# EAGLE design seeeduino nano (EAGLE 9.2.2)
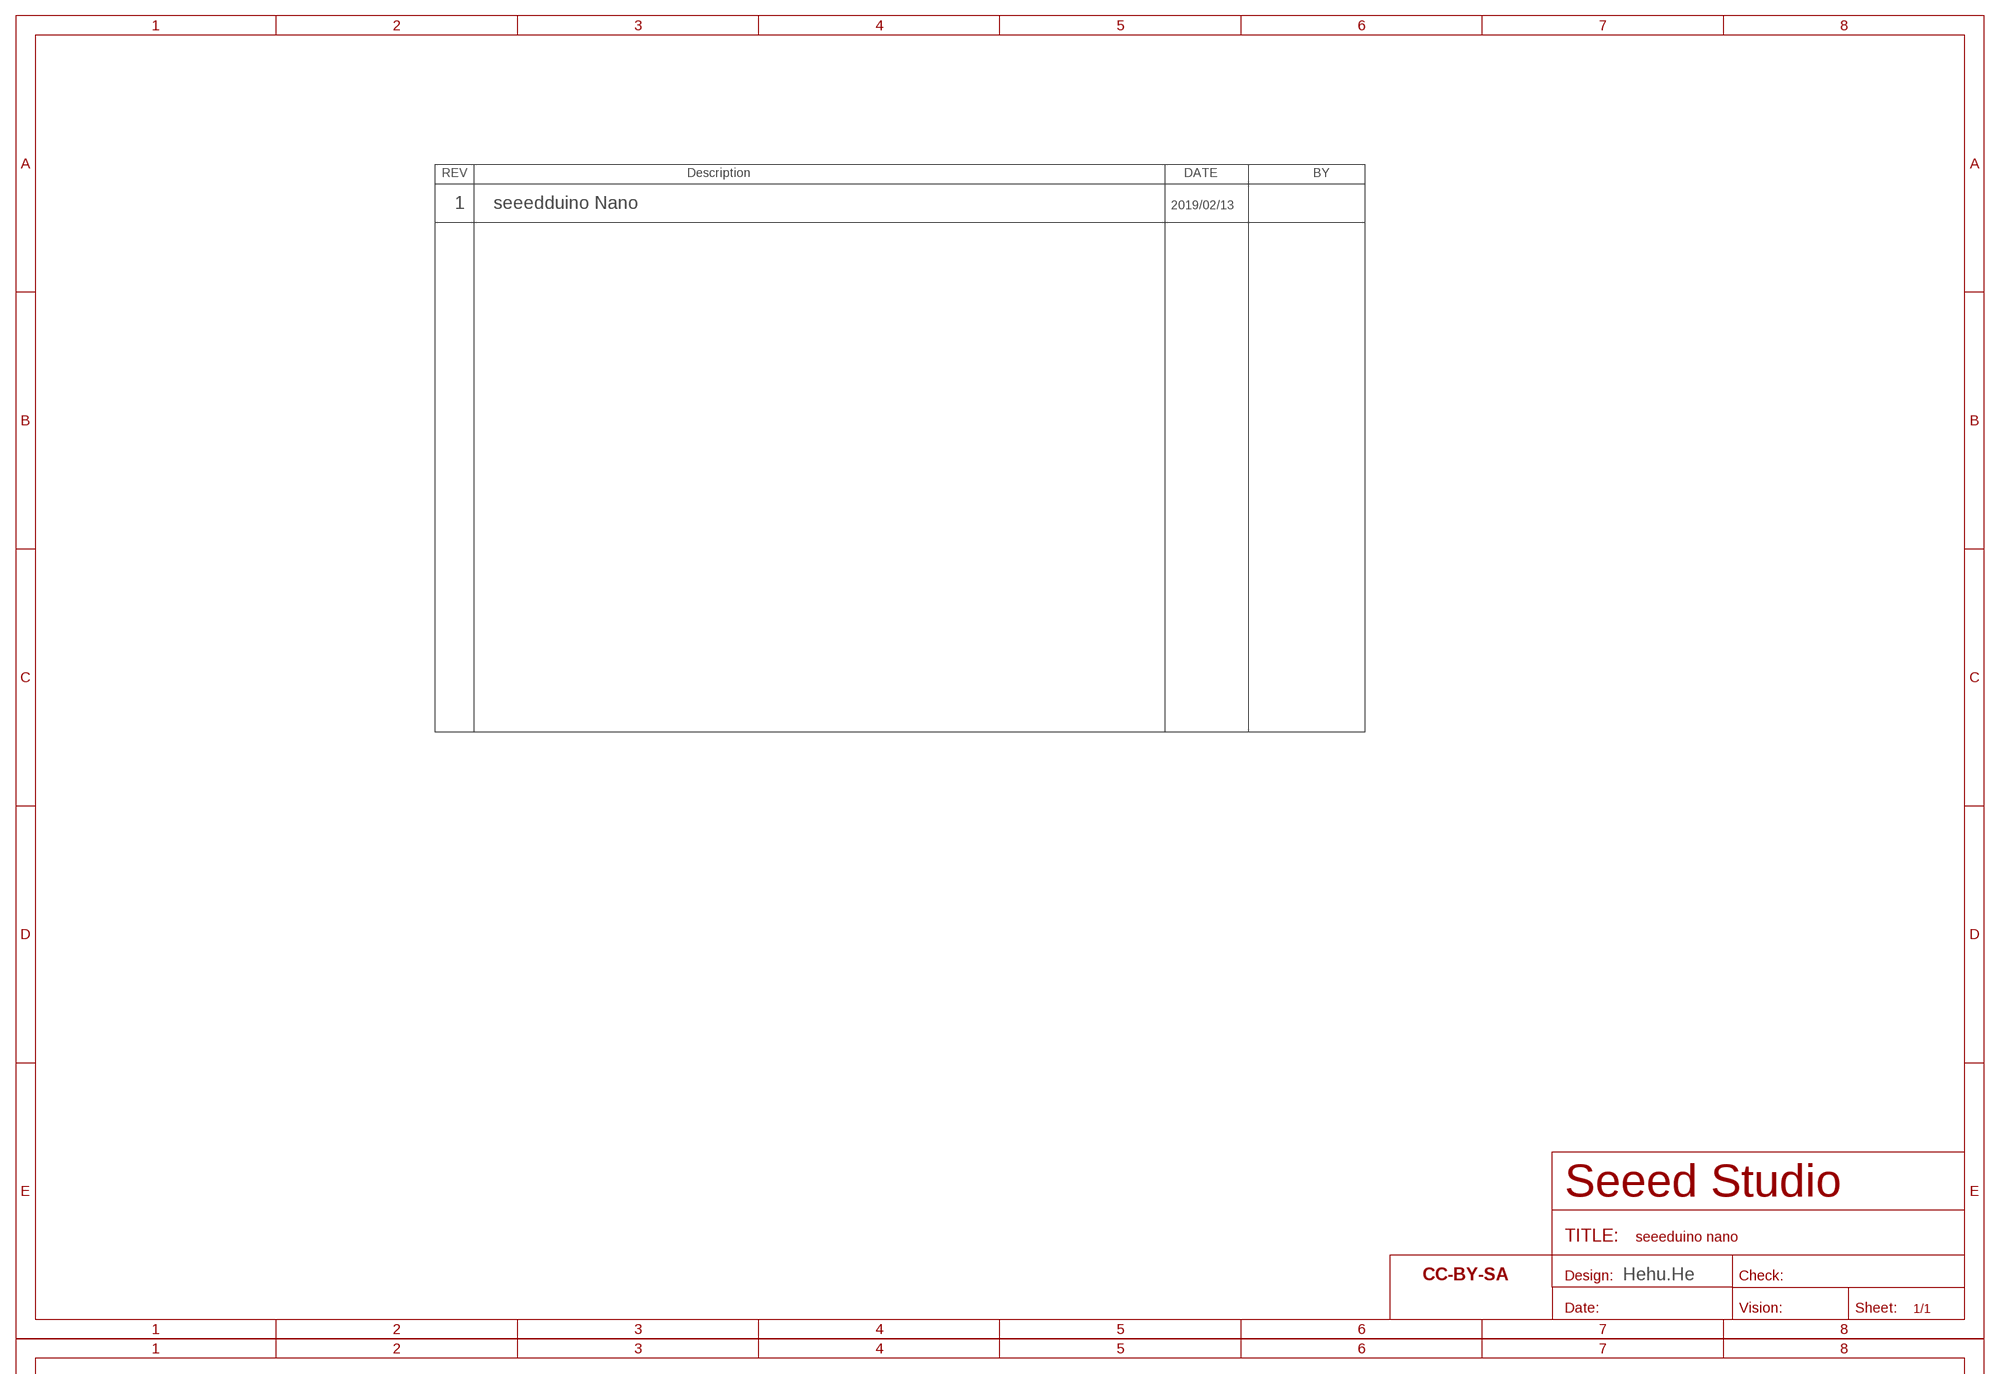
[diagram p0: schematic, sheet 1, part 1 of 2]
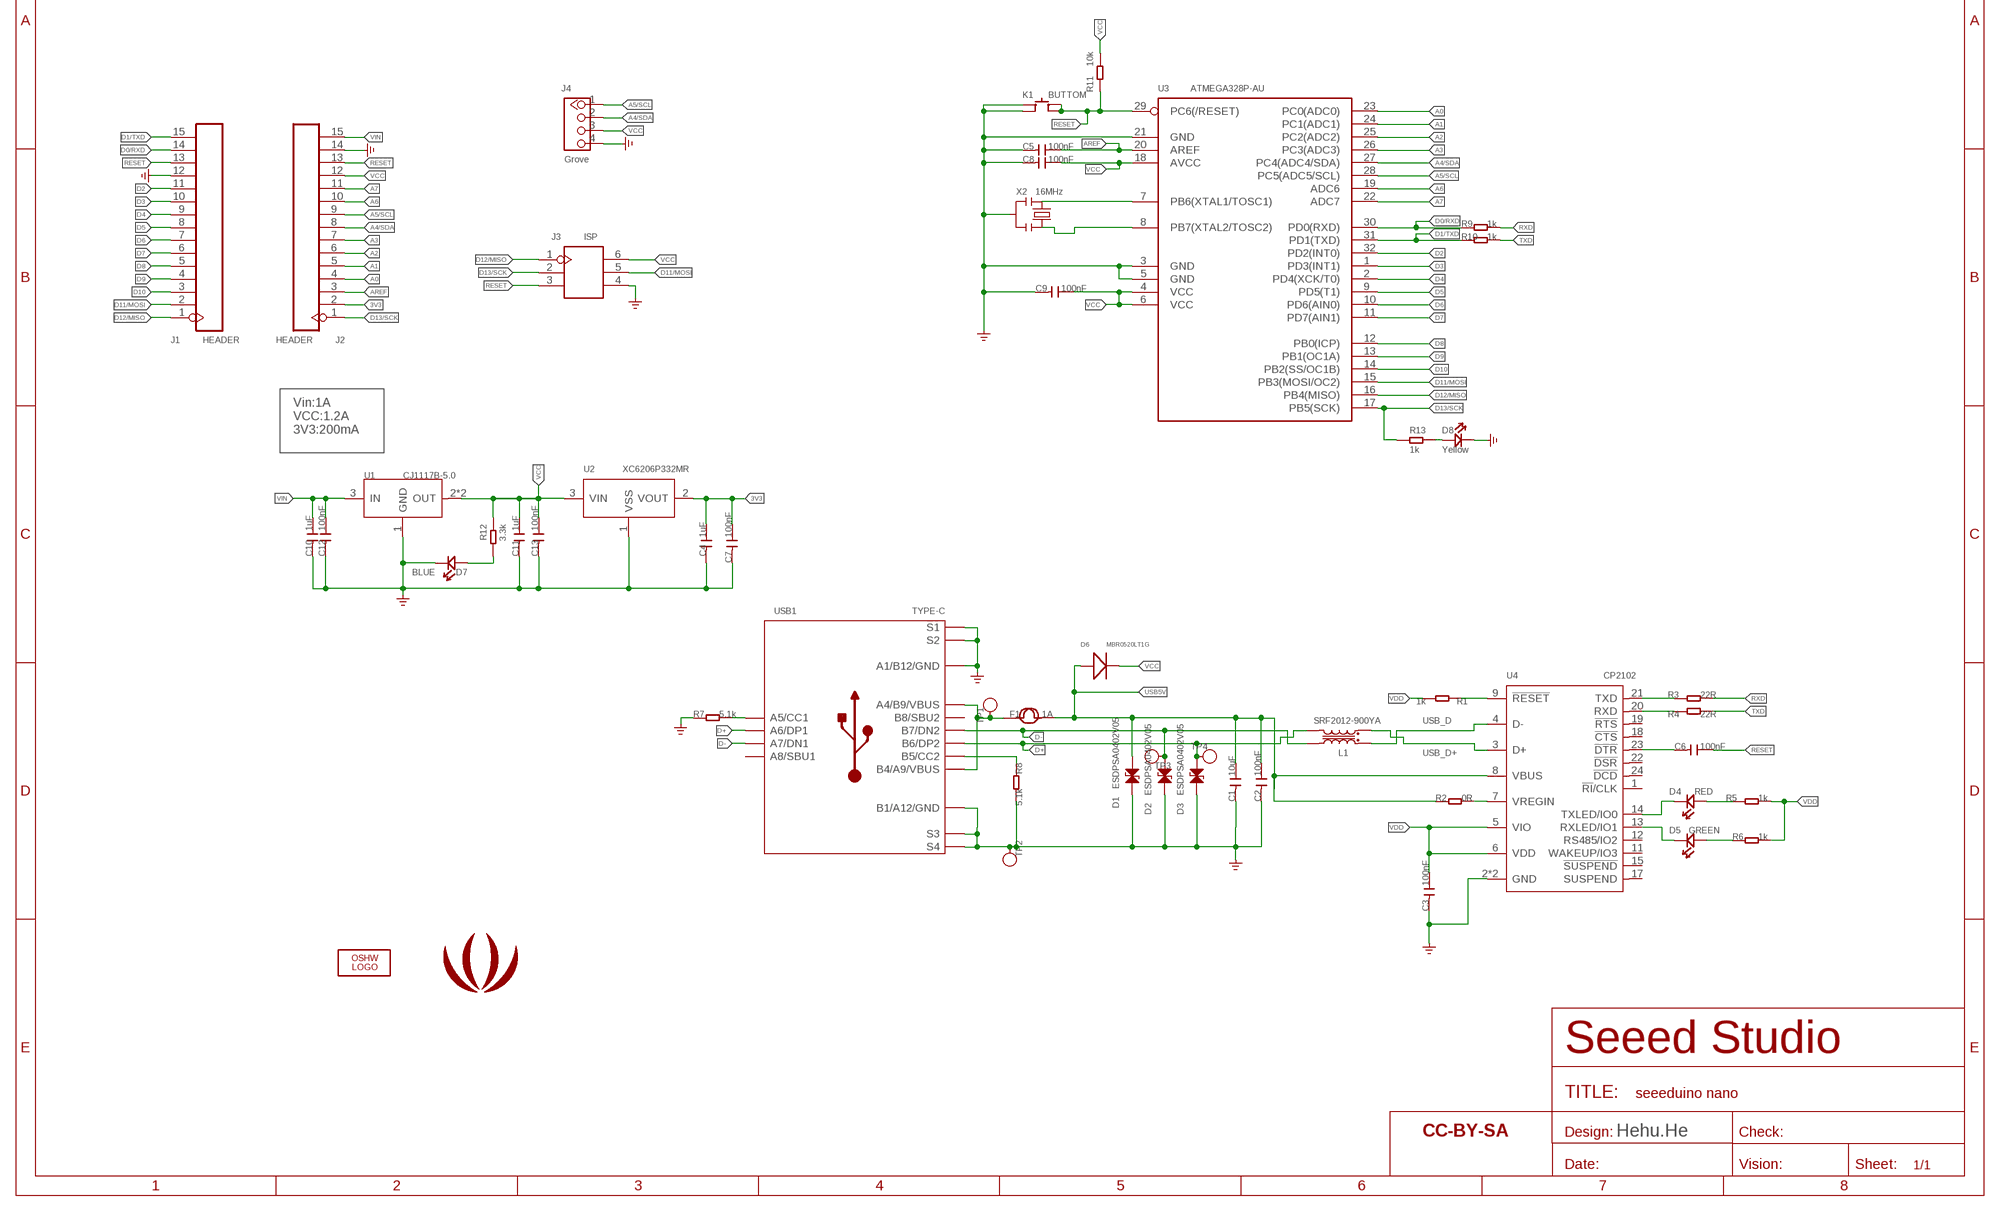
[diagram p1: schematic, sheet 1, part 2 of 2]

## Parts
C1  10uF  CAP-0603  [C0603]
C2  100nF  CAP-0603  [C0603]
C3  100nF  C-0603  [C0603]
C4  1uF  C-0603  [C0603]
C5  100nF  C-0603  [C0603]
C6  100nF  C-0603  [C0603]
C7  100nF  C-0603  [C0603]
C8  100nF  C-0603  [C0603]
C9  100nF  C-0603  [C0603]
C10  1uF  C-0603  [C0603]
C11  1uF  C-0603  [C0603]
C12  100nF  C-0603  [C0603]
C13  100nF  C-0603  [C0603]
D1  ESDPSA0402V05  D-ESD-2P-DOUBLE-0402  [ESD-0402]
D2  ESDPSA0402V05  D-ESD-2P-DOUBLE-0402  [ESD-0402]
D3  ESDPSA0402V05  D-ESD-2P-DOUBLE-0402  [ESD-0402]
D4  RED  LED-0402  [LED-0402]
D5  GREEN  LED-0402  [LED-0402]
D6  MBR0520LT1G  D'MBR0520LT1'  [SOD123-2.7X1.6]
D7  BLUE  LED-0402  [LED-0402]
D8  Yellow  LED-0402  [LED-0402]
F1  1A  FUSE'1206'  [F1206]
J1  HEADER  HEADER-15P'2.54'  [H15-2.54]
J2  HEADER  HEADER-15P'2.54'  [H15-2.54]
J3  ISP  HEADER-2X3P-2.54  [H2X3-2.54]
J4  Grove  GROVE-CONNECTOR-DIP-2.0  [HW4-2.0]
K1  BUTTOM  BUTTON-4P-4.5X3.2  [SW4P-SMD-4.5X3.2X2.5MM]
L1  SRF2012-900YA  INDUCTOR-COMMON-MODE-SRF2012-900YA  [INT4-0.85-2X1.25X1.2MM]
LOGO1  LOGO-OSHW-FILLX0100-NT  [OSHW_FILLX100_NOTEXT]
R1  1k  R-0603  [R0603]
R2  0R  R-0603  [R0603]
R3  22R  R-0603  [R0603]
R4  22R  R-0603  [R0603]
R5  1k  R-0603  [R0603]
R6  1k  R-0603  [R0603]
R7  5.1k  R-0603  [R0603]
R8  5.1k  R-0603  [R0603]
R9  1k  R-0603  [R0603]
R10  1k  R-0603  [R0603]
R11  10k  R-0603  [R0603]
R12  3.3k  R-0603  [R0603]
R13  1k  R-0603  [R0603]
TP1  TEST  TEST-POINT'4545'  [TP-D45MIL]
TP2  TEST  TEST-POINT'4545'  [TP-D45MIL]
TP3  TEST  TEST-POINT'4545'  [TP-D45MIL]
TP4  TEST  TEST-POINT'4545'  [TP-D45MIL]
U1  CJ1117B-5.0  PMIC-CJ1117S  [SOT-223]
U2  XC6206P332MR  PMIC-XC6206PMR  [SOT-23]
U3  ATMEGA328P-AU  MCU-ATMEGA8/168/328'AU'  [TQFP32-0.8-7X7MM]
U4  CP2102  CONVERTER-CP2102N(QFN24)  [QFN24G-0.5-4X4MM]
U$2  LOGO-SEEED-SMALL-SILK  [SEEED-SILK--TNAME-160*153MIL]
USB1  TYPE-C  USB2.0-TYPE-C  [USB2.0-TYPE-C]
X2  16MHz  CRYSTAL-RESONATOR  [RESONATOR3-SMD-3.6X1.3X0.8MM]

## Nets
3V3: C4.1 C7.1 J2.2 U2.2(VOUT)
A0: J2.4 U3.23(PC0(ADC0))
A1: J2.5 U3.24(PC1(ADC1))
A2: J2.6 U3.25(PC2(ADC2))
A3: J2.7 U3.26(PC3(ADC3))
A4/SDA: J2.8 J4.2 U3.27(PC4(ADC4/SDA))
A5/SCL: J2.9 J4.1 U3.28(PC5(ADC5/SCL))
A6: J2.10 U3.19(ADC6)
A7: J2.11 U3.22(ADC7)
AREF: C5.1 J2.3 U3.20(AREF)
D0/RXD: J1.14 R9.1 U3.30(PD0(RXD))
D1/TXD: J1.15 R10.1 U3.31(PD1(TXD))
D2: J1.11 U3.32(PD2(INT0))
D3: J1.10 U3.1(PD3(INT1))
D4: J1.9 U3.2(PD4(XCK/T0))
D5: J1.8 U3.9(PD5(T1))
D6: J1.7 U3.10(PD6(AIN0))
D7: J1.6 U3.11(PD7(AIN1))
D8: J1.5 U3.12(PB0(ICP))
D9: J1.4 U3.13(PB1(OC1A))
D10: J1.3 U3.14(PB2(SS/OC1B))
D11/MOSI: J1.2 J3.5 U3.15(PB3(MOSI/OC2))
D12/MISO: J1.1 J3.1 U3.16(PB4(MISO))
D13/SCK: J2.1 J3.2 R13.1 U3.17(PB5(SCK))
D+: D3.2 L1.3 TP4.T USB1.A6(A6/DP1) USB1.B6(B6/DP2)
D-: D2.2 L1.2 TP3.T USB1.A7(A7/DN1) USB1.B7(B7/DN2)
GND: C1.2 C2.2 C3.2 C4.2 C5.2 C7.2 C8.2 C9.2 C10.2 C11.2 C12.2 C13.2 D1.1 D2.1 D3.1 D7.- D8.- J1.12 J2.14 J3.4 J4.4 K1.1(A0) K1.2(A1) R7.1 R8.2 TP2.T U1.1(GND) U2.1(VSS) U3.3(GND) U3.5(GND) U3.21(GND) U4.2(GND) U4.PAD(GND) USB1.A1_B12(A1/B12/GND) USB1.B1_A12(B1/A12/GND) USB1.S1 USB1.S2 USB1.S3 USB1.S4 USB1.S5(S1) USB1.S6(S2) X2.2 ; supply symbol labelled GND_POWER
N$1: R7.2 USB1.A5(A5/CC1)
N$2: R8.1 USB1.B5(B5/CC2)
N$3: D8.+ R13.2
N$4: F1.1 TP1.T USB1.A4_B9(A4/B9/VBUS) USB1.B4_A9(B4/A9/VBUS)
N$5: C6.2 U4.23(!DTR!)
N$6: D4.+ R5.1
N$7: U3.7(PB6(XTAL1/TOSC1)) X2.1
N$8: D5.- U4.13(RXLED/IO1)
N$9: U3.8(PB7(XTAL2/TOSC2)) X2.3
N$10: D7.+ R12.2
N$11: D5.+ R6.1
N$18: D4.- U4.14(TXLED/IO0)
N$19: R4.1 U4.20(RXD)
N$20: R3.1 U4.21(TXD)
N$24: R2.2 U4.7(VREGIN)
N$25: R1.2 U4.9(!RESET!)
RESET: C6.1 J1.13 J2.13 J3.3 K1.3(B0) K1.4(B1) R11.1 U3.29(PC6(/RESET))
RXD: R3.2 R9.2
TXD: R4.2 R10.2
USB5V: C1.1 C2.1 D1.2 D6.1(+) F1.2 R2.1 U4.8(VBUS)
USB_D: L1.1 U4.4(D-)
USB_D+: L1.4 U4.3(D+)
VCC: C8.1 C9.1 C11.1 C13.1 D6.2(-) J2.12 J3.6 J4.3 R11.2 R12.1 U1.2(OUT) U1.TER(OUT) U2.3(VIN) U3.4(VCC) U3.6(VCC) U3.18(AVCC)
VDD: C3.1 R1.1 R5.2 R6.2 U4.5(VIO) U4.6(VDD)
VIN: C10.1 C12.1 J2.15 U1.3(IN)
Unconnected: U4.1(!RI!/CLK) U4.11(WAKEUP/IO3) U4.12(RS485/IO2) U4.15(!SUSPEND!) U4.17(SUSPEND) U4.18(!CTS!) U4.19(!RTS!) U4.22(!DSR!) U4.24(!DCD!) USB1.A8(A8/SBU1) USB1.B8(B8/SBU2)

## Notes on the sheet
- 1 | seeedduino Nano | 2019/02/13
- Hehu.He
- Vin:1A
  VCC:1.2A
  3V3:200mA
- Hehu.He

## Library data of the parts
C1 C2 = Discrete-new:CAP: Ceramic Capacitors
C3-C13 = Discrete-small:C*: Ceramic Capacitors
D1-D3 = Discrete-new:D-ESD-2P-DOUBLE
D4 D5 D7 D8 = Discrete-new:LED
D6 = Discrete-smallsmall:D*
F1 = Discrete-new:FUSE
J1 J2 = Connector-new:HEADER-15P: Header 15 Standard 15-pin 0.1" header. Use with straight break away headers (SKU : PRT-00116), right angle break away headers (PRT-00553), swiss pins (PRT-00743), machine pins (PRT-00117), and female headers (PRT-00115).
J3 = Connector-new:HEADER-2X3P
J4 = Connector-new:GROVE-CONNECTOR-DIP: 4P-2.0:320110033;4P-2.0-90D:320110034
K1 = Switch:BUTTON-4P
L1 = Discrete-new:INDUCTOR-COMMON-MODE
LOGO1 = logo:LOGO-OSHW-FILL; PARTNO: DNP
R1-R13 = Discrete-small:R*
TP1-TP4 = Discrete-new:TEST-POINT; PARTNO: DNP
U1 = IC-new:PMIC-CJ*1117: Low Drop Fixed And Adjustable Positive Voltage Regulators http://www.datasheetcatalog.org/datasheet/SGSThomsonMicroelectronics/mXuqtqv.pdf
U2 = IC-new:PMIC-XC6206P: LOW ESR Cap.Compatible Positive Voltage Regulators
U3 = IC-new:MCU-ATMEGA8/168/328
U4 = IC-new:CONVERTER-CP2102N(QFN24)
U$2 = logo:LOGO-SEEED; PARTNO: DNP
USB1 = Connector-new:USB2.0-TYPE-C
X2 = Discrete-new:CRYSTAL-RESONATOR: Resonator Small SMD resonator. This is the itty bitty 10/20MHz resonators with built in caps. CSTCE10M0G55 and CSTCE20M0V53. Footprint has been reviewed closely but hasn't been tested yet.

## Board
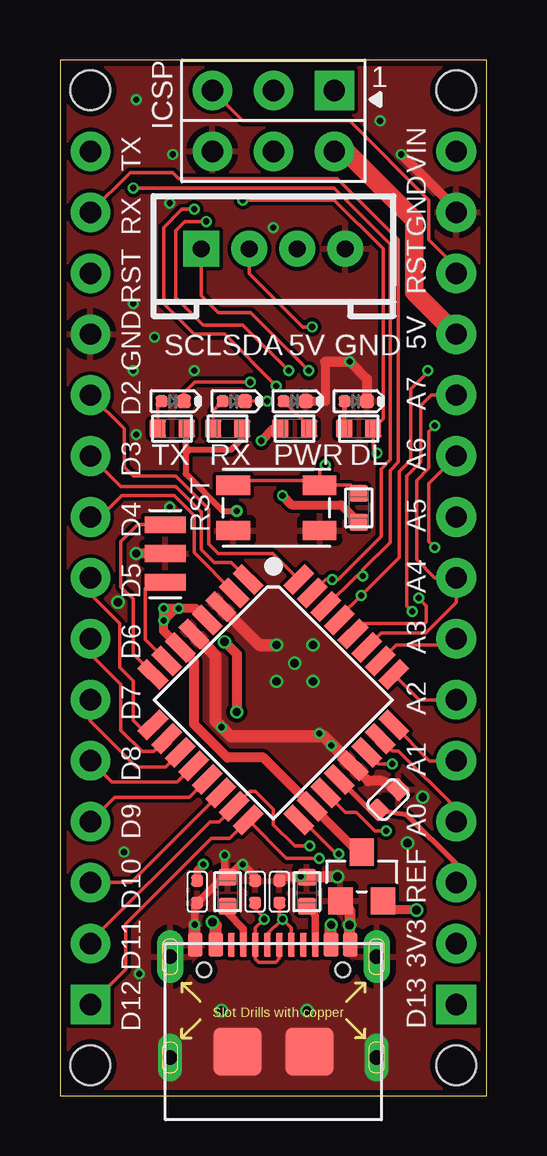
[diagram p2: board, top side]
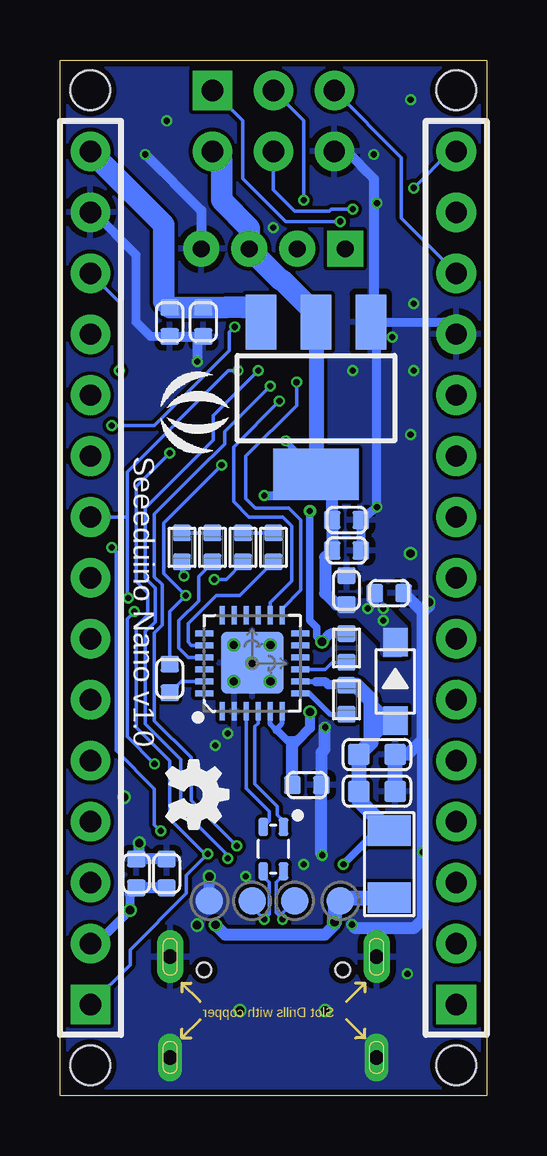
[diagram p3: board, bottom side, seen from below]

Size 17.78 x 43.18 mm. Coordinates in mm from the lower left corner, seen from the top.
Outline: 0,0 17.78,0 17.78,43.18 0,43.18 0,0
Copper layers (1*16): Top 0.035mm / dielectric 1.5mm / Bottom 0.035mm
Design rules "SeeedStudio_2layer_DRU_no_angle_20140221": minimum track width 1mil, minimum drill 10mil, track to track 6mil, track to pad 6mil, pad to pad 6mil, via to via 6mil, smd to smd 0mil, copper to edge 10mil, drill to drill 10mil, minimum pad ring 4mil, minimum via ring 4mil, stop-mask expansion 2mil, vias tented up to drill 25mil, thermal gap 10mil
Holes 1.65 mm at 1.27,1.27 16.51,1.27 16.51,41.91 1.27,41.91

### Footprints (pad centres in the part's own frame; a part is rotated, then mirrored left to right if it is on the bottom)
C0603 = smd 0.889 x 0.889: 1 -0.762,0; 2 0.762,0
C0603' = smd 0.696 x 0.762: 1 0.602,0; 2 -0.602,0
ESD-0402 = smd 0.5 x 0.5: 1 -0.463,0; 2 0.463,0
LED-0402 = smd 0.5 x 0.5: + 0.463,0 | smd 0.58 x 0.58: - -0.468,0
SOD123-2.7X1.6 = smd 1.2 x 1.02: 1 -1.635,0; 2 1.635,0
F1206 = smd 1.27 x 1.778: 1 -1.397,0; 2 1.397,0
H15-2.54 = drill 0.889 pad 1.651 square: 1 0,-17.78 | drill 0.889 pad 1.651: 2 0,-15.24; 3 0,-12.7; 4 0,-10.16; 5 0,-7.62; 6 0,-5.08; 7 0,-2.54; 8 0,0; 9 0,2.54; 10 0,5.08; 11 0,7.62; 12 0,10.16; 13 0,12.7; 14 0,15.24; 15 0,17.78
H2X3-2.54 = drill 0.889 pad 1.651 square: 1 -1.27,2.54 | drill 0.889 pad 1.651: 2 -1.27,0; 3 -1.27,-2.54; 4 1.27,-2.54; 5 1.27,0; 6 1.27,2.54
HW4-2.0 = drill 0.7 pad 1.5 square: 1 -3,0 | drill 0.7 pad 1.5: 2 -1,0; 3 1,0; 4 3,0
SW4P-SMD-4.5X3.2X2.5MM = smd 1.4 x 0.8: 1 -1.8,-0.94; 2 1.8,-0.94; 3 1.8,0.94; 4 -1.8,0.94
INT4-0.85-2X1.25X1.2MM = smd 0.4 x 0.75: 1 -0.425,-0.925; 2 -0.425,0.925; 3 0.425,0.925; 4 0.425,-0.925
R0603 = smd 0.762 x 0.696: 1 0,0.602; 2 0,-0.602
TP-D45MIL = smd 1.143 x 1.143: T 0,0
SOT-223 = smd 1.27 x 2.286: 1 -2.286,-3.175; 2 0,-3.175; 3 2.286,-3.175 | smd 3.556 x 2.159: TER 0,3.175
SOT-23 = smd 1.016 x 1.143: 1 -0.889,-1.016; 2 0.889,-1.016; 3 0,1.016
TQFP32-0.8-7X7MM = smd 1.27 x 0.559: 1 -4.293,2.8; 2 -4.293,2; 3 -4.293,1.2; 4 -4.293,0.4; 5 -4.293,-0.4; 6 -4.293,-1.2; 7 -4.293,-2; 8 -4.293,-2.8; 17 4.293,-2.8; 18 4.293,-2; 19 4.293,-1.2; 20 4.293,-0.4; 21 4.293,0.4; 22 4.293,1.2; 23 4.293,2; 24 4.293,2.8 | smd 0.559 x 1.27: 9 -2.8,-4.293; 10 -2,-4.293; 11 -1.2,-4.293; 12 -0.4,-4.293; 13 0.4,-4.293; 14 1.2,-4.293; 15 2,-4.293; 16 2.8,-4.293; 25 2.8,4.293; 26 2,4.293; 27 1.2,4.293; 28 0.4,4.293; 29 -0.4,4.293; 30 -1.2,4.293; 31 -2,4.293; 32 -2.8,4.293
QFN24G-0.5-4X4MM = smd 0.26 x 0.8: 1 -1.25,-2; 2 -0.75,-2; 3 -0.25,-2; 4 0.25,-2; 5 0.75,-2; 6 1.25,-2; 13 1.25,2; 14 0.75,2; 15 0.25,2; 16 -0.25,2; 17 -0.75,2; 18 -1.25,2 | smd 0.8 x 0.26: 7 2,-1.25; 8 2,-0.75; 9 2,-0.25; 10 2,0.25; 11 2,0.75; 12 2,1.25; 19 -2,1.25; 20 -2,0.75; 21 -2,0.25; 22 -2,-0.25; 23 -2,-0.75; 24 -2,-1.25 | smd 2.6 x 2.6: PAD 0.01,0.02
USB2.0-TYPE-C = smd 1 x 0.6: A1_B12 -0.05,3.25; A4_B9 -0.05,2.4; B1_A12 -0.05,-3.2; B4_A9 -0.05,-2.4 | smd 1 x 0.3: A5 -0.05,1.25; A6 -0.05,0.25; A7 -0.05,-0.25; A8 -0.05,-1.25; B5 -0.05,-1.75; B6 -0.05,-0.75; B7 -0.05,0.75; B8 -0.05,1.75 | drill 0.6 pad 1 long: S1 -4.75,4.3; S2 -4.75,-4.3 | drill 0.6 pad 1.1 long: S3 -0.55,4.3; S4 -0.55,-4.3 | smd 2 x 2: S5 -4.5,1.5; S6 -4.5,-1.5 | hole 0.6: -1.1,-2.89; -1.1,2.89
RESONATOR3-SMD-3.6X1.3X0.8MM = smd 0.7 x 1.7: 1 -1.2,0; 2 0,0; 3 1.2,0

### Placement (x,y rotation side)
C1  4.57,12.7 0 bottom
C2  4.57,14.22 0 bottom
C3  100nF  [C0603']  7.49,12.95 180 bottom
C4  1uF  [C0603']  14.61,9.27 270 bottom
C5  100nF  [C0603']  13.67,12.34 225 top
C6  100nF  [C0603']  13.21,17.4 90 bottom
C7  100nF  [C0603']  13.34,9.27 270 bottom
C8  100nF  [C0603']  5.84,21.08 270 bottom
C9  100nF  [C0603']  4.06,20.95 180 bottom
C10  1uF  [C0603']  13.21,32.26 90 bottom
C11  1uF  [C0603']  5.84,22.73 180 bottom
C12  100nF  [C0603']  11.81,32.26 90 bottom
C13  100nF  [C0603']  5.84,24 180 bottom
D1  5.71,8.51 90 top
D2  8.13,8.51 270 top
D3  9.14,8.51 270 top
D4  7.24,28.96 180 top
D5  4.7,28.96 180 top
D6  3.81,17.27 90 bottom
D7  9.78,28.96 180 top
D8  12.32,28.96 180 top
F1  4.06,9.65 90 bottom
J1  1.27,21.59 0 bottom
J2  16.51,21.59 0 bottom
J3  8.89,40.64 270 top
J4  8.89,35.31 0 top
K1  9.02,24.51 0 top
L1  8.89,10.29 180 bottom
LOGO1  13.34,13.97 270 bottom
R1  5.84,18.67 0 bottom
R2  5.84,16.51 0 bottom
R3  11.43,22.86 180 bottom
R4  8.89,22.86 180 bottom
R5  6.99,27.81 90 top
R6  4.67,27.81 90 top
R7  6.99,8.51 0 top
R8  10.29,8.51 180 top
R9  12.7,22.86 180 bottom
R10  10.16,22.86 180 bottom
R11  12.45,24.51 0 top
R12  9.78,27.81 90 top
R13  12.45,27.81 270 top
TP1  6.1,8.13 90 bottom
TP2  11.56,8.13 90 bottom
TP3  8,8.13 90 bottom
TP4  9.78,8.13 90 bottom
U1  7.11,29.08 180 bottom
U2  12.57,9.14 0 top
U3  8.89,16.51 315 top
U4  9.78,18.03 0 bottom
U$2  12.06,28.45 270 bottom
USB1  8.89,6.35 90 top
X2  4.38,22.61 90 top

### Tracks (layer width: path | path; a pad name or v marks a point on that pad's centre or on a via)
3V3  (via drill 0.35)
  Top 0.381: v14.86,7.75 13.84,7.75 U2.2
  Bottom 0.381: J2.2 16.26,6.35 v14.86,7.75 14.86,8.41
  Bottom 0.457: 14.86,8.41 C4.1 C7.1
A0
  Top 0.152: U3.23 13.85,14.38 14.1,14.38 16.51,11.97 J2.4
A1
  Top 0.152: U3.24 15.39,13.97 J2.5
A2
  Top 0.152: U3.25 14.96,16.51 J2.6
A3
  Top 0.152: J2.7 16.26,18.8 14,18.8 U3.26
A4/SDA  (via drill 0.25)
  Top 0.152: U3.27 13.38,19.3 15.24,19.3 16.51,20.57 J2.8 15.62,21.59 14.86,22.35 14.86,25.65 15.37,26.16 15.37,27.69 v15.62,27.94 | v10.5,32.05 10.11,32.05 7.89,34.27 J4.2
  Bottom 0.152: v15.62,27.94 13.84,27.94 10.72,31.06 10.72,31.84 v10.5,32.05
A5/SCL  (via drill 0.25)
  Top 0.152: U3.28 12.63,19.68 15.19,19.68 15.27,19.76 15.27,20.42 v14.94,20.75 | v10.36,30.23 7.95,32.64 6.6,32.64 5.89,33.35 J4.1
  Bottom 0.152: 14.99,24.13 14.99,26.01 10.77,30.23 v10.36,30.23 | 14.99,24.13 14.99,20.75 v14.94,20.75 | J2.9 14.99,24.13
A6  (via drill 0.25)
  Top 0.152: J2.10 15.37,25.53 15.37,23.11 v15.62,22.86 | U3.19 11.89,11.81 12.35,11.81 13.11,11.05 v13.59,11.05
  Bottom 0.152: v13.59,11.05 13.84,11.3 13.84,12.79 15.44,14.39 15.44,22.68 v15.62,22.86
A7  (via drill 0.25)
  Top 0.152: U3.22 13.25,13.84 v13.84,13.84 | v14.68,20.19 14.45,20.42 14.45,25.83 15.04,26.42 15.04,28.78 15.47,29.21 J2.11
  Bottom 0.152: v13.84,13.84 14.99,14.99 14.99,19.89 v14.68,20.19
AREF
  Top 0.203: J2.3 16.51,9.66 14.43,11.74 C5.1 13.09,11.74 U3.20
D0/RXD  (via drill 0.25)
  Top 0.152: U3.30 12.36,21.68 v12.61,21.68 12.61,21.93 13.76,23.07 13.76,26.07 14.1,26.42 14.1,35.69 11.56,38.23 11.43,38.23 4.95,38.23 4.7,38.48 2.92,38.48 J1.14
  Bottom 0.152: R9.1 12.7,21.76 v12.61,21.68
D1/TXD  (via drill 0.25)
  Top 0.152: U3.31 11.08,21.53 v11.35,21.53 11.59,21.53 13.38,23.32 13.38,26.13 13.77,26.52 13.77,35.51 11.43,37.85 v3.05,37.85
  Bottom 0.152: R10.1 10.16,22.23 10.86,21.53 v11.35,21.53 | v3.05,37.85 1.52,39.37 J1.15
D2
  Top 0.152: U3.32 8.87,22.61 7.24,22.61 6.6,22.61 6.2,23.01 6.2,24.46 5.8,24.85 4.83,25.83 3.05,25.83 2.67,26.21 2.67,27.81 J1.11
D3
  Top 0.152: J1.10 2.54,25.4 4.83,25.4 5.89,24.33 5.89,22.77 6.43,22.23 7.13,22.23 U3.1
D4
  Top 0.152: U3.2 5.59,22.64 5.59,24.18 4.75,25.02 2.56,25.02 1.68,24.13 J1.9
D5
  Top 0.152: U3.9 3.75,15.33 3.37,15.33 3.05,15.65 3.05,17.29 2.49,17.85 2.49,19.68 1.22,20.95 1.22,21.54 J1.8
D6
  Top 0.152: U3.10 3.9,14.35 3.43,14.35 2.54,15.24 2.54,17.14 1.27,18.41 J1.7
D7
  Top 0.152: U3.11 4.4,13.72 3.17,13.72 1.27,15.62 J1.6
D8
  Top 0.152: U3.12 4.89,13.08 2.16,13.08 J1.5
D9
  Top 0.152: J1.4 2.29,12.45 5.39,12.45 U3.13
D10
  Top 0.152: U3.14 2.97,8.89 J1.3
D11/MOSI  (via drill 0.25)
  Top 0.152: J1.2 1.27,6.44 6.25,11.43 6.63,11.43 U3.15 7.91,12.7 8.13,12.7 8.89,11.94 8.89,11.3 9.78,10.41 v10.41,10.41 | v9.02,29.59 6.86,31.75 5.59,31.75 4.32,33.02 4.32,36.2 5.08,36.96 v5.59,36.96
  Bottom 0.152: v10.41,10.41 12.32,12.32 12.32,14.1 13.84,15.62 13.84,19.3 13.51,19.63 13.51,21.31 13.84,21.64 13.84,24.26 12.06,26.04 10.92,27.18 10.92,27.69 v9.02,29.59 | J3.5 8.89,37.77 8,36.88 6.55,36.88 6.48,36.96 v5.59,36.96
D12/MISO  (via drill 0.25)
  Top 0.152: J1.1 2.74,5.28 2.74,7.16 6.31,10.73 7.07,10.73 U3.16 9.42,9.91 v10.79,9.91 | v9.53,30.23 7.62,32.13 7.11,32.13 5.97,32.13 4.83,33.27 4.83,36.07 5.21,36.45 v6.1,36.45
  Bottom 0.152: v9.53,30.23 11.39,28.36 11.39,27.34 14.22,24.51 14.22,21.59 14.15,21.51 13.82,21.18 13.82,19.76 14.22,19.35 14.22,15.49 12.75,14.02 12.75,11.99 10.79,10.03 v10.79,9.91 | v6.1,36.45 8.38,36.45 10.16,38.23 10.16,40.64 J3.1
D13/SCK  (via drill 0.25)
  Top 0.152: U3.17 10.26,11.19 10.41,11.19 11.51,10.09 v11.62,10.09 | v7.62,37.34 11.43,37.34 13.46,35.31 13.46,28.23 R13.1 13.05,26.96 v13.21,26.8
  Bottom 0.152: J2.1 14.86,5.46 14.86,6.08 12.51,8.43 12.51,9.2 v11.62,10.09 11.68,10.02 13.21,11.55 13.21,13.97 14.61,15.37 14.61,19.56 14.12,20.04 14.12,20.95 14.61,21.44 14.61,25.4 v13.21,26.8 | J3.2 7.62,40.64 v7.62,37.34
D+  (via drill 0.25)
  Top 0.152: USB1.B6 9.64,7 v9.27,7.37 | v9.27,7.37 v9.26,7.37 8.64,6.75 USB1.A6 | D3.2 9.14,7.49 v9.27,7.37
  Bottom 0.152: TP4.T 9.78,7.87 v9.27,7.37 9.07,7.57 9.07,8.89 9.31,9.14 L1.3
D-  (via drill 0.25)
  Top 0.152: USB1.A7 9.15,5.73 8.98,5.57 8.27,5.57 8.14,5.7 USB1.B7 8.14,7 v8.51,7.37 8.51,7.41 8.13,7.79 D2.2
  Bottom 0.152: TP3.T 8.51,7.62 v8.51,7.37 8.76,7.62 8.76,8.89 8.46,9.19 L1.2
GND  (via drill 0.25, 0.35)
  Top 0.305: R7.1 6.86,9.24 v6.86,10.03 | v5.61,7.14 5.61,7.94 D1.1 6.78,9.11 R7.1 | D2.1 8.13,9.14 v7.62,9.65 7.65,9.62 7.49,9.62 R7.1
  Top 0.381: 11.05,30.61 11.07,30.58 11.07,28.96 D7.-
  Top 0.406: J2.14 16.51,36.96 v14.22,39.24 | D3.1 9.14,9.14 v10.03,9.14 | 11.05,30.61 v12.06,30.61 12.79,29.89 D8.- | X2.2 v3.17,22.61 | U3.21 12.84,13.12 13.43,13.12 C5.2
  Top 0.457: USB1.B1_A12 12.06,6.33 v12.06,7.11 12.06,7.75 U2.1 | R8.2 10.32,9.14 v11.56,9.14
  Top 0.508: U3.5 6.17,18.66 6.17,18.64 6.48,18.34 6.48,15.62 v6.73,15.37 7.11,14.99 10.98,14.99 U3.21 | U3.3 8.3,18.8 v9.02,18.8 | USB1.A1_B12 5.61,6.33 v5.61,7.14
  Bottom 0.381: J1.12 1.78,32.26 U1.1 4.83,32.38 4.57,32.13 v4.57,24.54 C13.2 C11.2 | C10.2 14,31.66 14.61,32.26 14.61,35.05 16.38,36.83 J2.14
  Bottom 0.406: v12.06,30.61 12.06,31.66 C10.2 | v14.22,39.24 11.89,36.91 J4.4 | J3.4 5.84,39.37 4.7,38.23 4.7,32.38 U1.1
  Bottom 0.457: C7.2 C4.2 14.48,10 v14.48,10.54 | TP2.T v11.56,9.14
  Bottom 0.508: v6.73,15.37 6.76,15.34 6.76,14.45 6.89,14.31 C3.2 6.89,10.07 v6.86,10.03 | C2.2 3.3,14.22 2.67,14.86 | 2.67,20.16 C9.2 | 2.67,14.86 2.67,20.16 | v2.41,20.57 2.41,20.41 2.67,20.16 | 2.67,14.86 2.67,7.37 3.04,6.99 5.47,6.99 v5.61,7.14
  Bottom 0.635: C1.2 C2.2
  other vias: 15.11,12.45 10.54,18.8 9.02,17.27 10.54,17.27 9.78,18.03 3.3,5.08 3.17,27.56 3.05,30.23 3.05,33.02 3.94,31.62 4.57,37.21 4.7,39.24 13.34,40.64 5.59,30.23 10.79,15.11 11.3,14.61 6.73,3.56 10.29,3.56 3.17,41.53 2.67,10.16 8.89,36.2
  pour Bottom (rank 6): -0.25,43.43 17.91,43.43 17.91,41.27 17.91,-0.25 5.21,-0.25 -0.25,-0.25
  pour Top (rank 6): -0.25,43.43 17.91,43.43 17.91,-0.25 -0.25,-0.25
N$1
  Top 0.305: USB1.A5 7.64,6.96 6.99,7.62 R7.2
N$2
  Top 0.305: USB1.B5 10.64,7.55 R8.1
N$3
  Top 0.203: R13.2 D8.+
N$4  (via drill 0.35)
  Top 0.305: 11.29,7.11 v11.3,7.13
  Top 0.508: USB1.B4_A9 11.29,7.11 | USB1.A4_B9 6.49,7.1 v6.35,7.24
  Bottom 0.305: 10.91,6.73 7.24,6.73
  Bottom 0.508: 6.35,7.49 6.35,7.11 6.73,6.73 7.24,6.73 10.91,6.73 v11.3,7.13 | v6.35,7.24 6.35,7.87 TP1.T
  Bottom 0.635: TP1.T 5.97,8.26 F1.1 | 6.35,7.49 v6.35,7.24
N$5
  Bottom 0.152: C6.2 12.72,17.28 U4.23
N$6
  Top 0.152: R5.1 6.38,28.56 D4.+
N$7
  Top 0.152: X2.1 3.81,21.41 3.56,21.15 3.56,19.02 U3.7
N$8  (via drill 0.25)
  Top 0.152: v7.92,29.74 5.61,29.74 5.17,29.3 D5.-
  Bottom 0.152: v7.92,29.74 7.92,28.78 10.03,26.67 10.03,24.89 9.65,24.51 8.26,24.51 7.75,24 7.75,21.08 8.53,20.3 U4.13
N$9
  Top 0.152: U3.8 3.88,17.59 3.05,18.41 3.05,20.7 2.54,21.21 2.54,23.11 3.23,23.81 X2.3
N$10
  Top 0.152: D7.+ 10.38,27.89 R12.2
N$11
  Top 0.152: R6.1 4.07,28.79 D5.+
N$18  (via drill 0.25)
  Top 0.152: v8.64,28.96 D4.-
  Bottom 0.152: v8.64,28.96 10.54,27.05 10.54,24.77 9.91,24.13 8.51,24.13 8.13,23.75 8.13,21.46 9.03,20.56 U4.14
N$19
  Bottom 0.152: R4.1 10.29,20.86 11.27,20.86 12.45,19.68 12.45,18.92 12.31,18.78 U4.20
N$20
  Bottom 0.152: R3.1 11.43,22.23 12,21.65 12,20.64 12.83,19.81 12.83,18.67 12.44,18.28 U4.21
N$24
  Bottom 0.152: U4.7 7.39,16.78
  Bottom 0.203: R2.2 6.51,15.91 7.39,16.78
N$25
  Bottom 0.152: R1.2 6.44,18.07 6.73,17.78 U4.9
RESET  (via drill 0.25)
  Top 0.152: U3.29 11.64,19.95 v12.54,20.86 14.13,22.44 14.13,26.02 14.61,26.49 14.61,29.46 15.32,30.18 v15.32,30.23 | J3.3 7.62,40.64 12.06,40.64 15.37,37.34 15.37,35.69 16.51,34.54 J2.13 | K1.4 7.42,25.65 10.61,25.65 K1.3 | v11.05,26.29 10.82,26.06 K1.3 | K1.3 12.11,25.45 R11.1
  Bottom 0.152: J1.13 3.56,36.58 3.56,39.12 J3.3 | v15.32,30.23 15.32,33.1 J2.13 | C6.1 13.21,20.19 v12.54,20.86 13.46,21.77 13.46,23.88 v11.05,26.29
RXD
  Bottom 0.152: R9.2 R3.2
TXD
  Bottom 0.152: R10.2 R4.2
USB5V  (via drill 0.25 pad 0.46)
  Top 0.305: D1.2 5.71,9.4 v5.97,9.65
  Bottom 0.203: 7.12,17.28 7.11,17.27 7.12,17.28 | U4.8 7.12,17.28
  Bottom 0.305: v5.97,9.65 4.57,11.05 F1.2
  Bottom 0.381: 7.11,17.27 6.73,17.27 6.6,17.14 5.88,17.14 R2.1
  Bottom 0.635: R2.1 5.43,17.11 4.83,16.51 4.83,16.26 | 4.83,16.26 4.21,15.64 D6.1 4.17,15.64 4.83,14.99 | 4.83,16.26 4.83,14.99 | 4.83,14.99 4.83,14.73 C2.1 C1.1 5.33,12.32 F1.2
USB_D
  Bottom 0.152: L1.1 8.46,11.47 8.72,11.72 8.72,12.06 9.66,13 9.66,15.4 9.53,15.53 U4.4
USB_D+
  Bottom 0.152: U4.3 10.03,12.81 9.06,11.85 9.06,11.47 L1.4
VCC  (via drill 0.25)
  Top 0.381: U3.4 5.65,20.32 v4.95,20.32 | U3.6 4.32,19.39 v4.32,20.32 v4.95,20.32 | v4.32,19.81 4.83,20.32 v4.95,20.32 | v9.27,25.02 9.65,24.64 11.72,24.64 R11.2 | v8.38,27.3 8.89,27.81 R12.1 | U3.18 12.41,10.16 U2.3
  Top 0.406: U3.18 8.47,14.1 6.98,14.1 5.59,15.49 5.59,18.11 U3.6
  Top 0.762: J3.6 11.91,39.37 14.76,36.52 14.76,33.5 J2.12
  Bottom 0.152: U1.2 7.11,32.59
  Bottom 0.254: v8.38,27.3 7.11,26.04 U1.TER
  Bottom 0.381: C9.1 4.67,20.61 v4.95,20.32 | v9.27,25.02 8,25.02 U1.TER
  Bottom 0.508: C8.1 6.26,20.48 6.73,20.95 6.73,22.45 C11.1 C13.1 6.44,25.24 U1.TER
  Bottom 0.635: U1.2 U1.TER
  Bottom 0.889: 7.11,32.59 8.52,34 8.58,34 J4.3 9.89,36.18 11.05,37.34 11.05,38.99 J3.6
  pour Bottom (no thermals): 3.3,18.92 3.3,19.56 4.45,20.7 6.1,20.7 6.22,20.57 6.22,20.07 6.1,19.94 5.59,19.94 5.46,19.94 4.45,18.92 4.45,18.41 4.32,18.29 4.19,18.29 3.56,18.29 3.3,18.54
VDD  (via drill 0.25 pad 0.51, 0.35)
  Top 0.152: 5.23,26.8 5.33,26.8 5.46,26.92 5.23,27.16 5.23,27.18 | R6.2 5.23,27.77
  Top 0.254: 5.23,26.92 5.23,26.8 5.23,25.93 6.78,24.38 v7.37,24.38 | 5.23,26.92 5.23,27.18 5.23,27.77 | R5.2 7.59,27.4 7.11,26.92 5.46,26.92 5.23,26.92
  Top 0.406: v6.86,18.92 7.37,18.41 v7.37,16
  Bottom 0.203: 8.77,15.28 8.53,15.53 U4.6 | 8.76,15.24 9.03,15.51 U4.5
  Bottom 0.305: 8.33,14.84 8.1,14.61 | 7.86,14.84 8.33,14.84 | v6.86,18.92 7.07,19.14 7.07,19.52 7.37,19.82 v7.37,24.38 | 8.33,14.84 8.77,15.28 8.77,15.25 8.76,15.24
  Bottom 0.406: R1.1 6.51,19.27 v6.86,18.92 | v7.37,16 7.37,15.33 7.86,14.84 8.1,14.61
  Bottom 0.508: C3.1 8.1,14.61
VIN
  Bottom 0.635: U1.3 9.4,32.38 | 9.87,32.86 C12.1 C10.1 13.46,33.11
  Bottom 0.889: J2.15 13.46,36.32 13.46,33.11 | 9.4,32.38 9.87,32.86 10.14,32.86 10.16,32.88 10.84,32.88 10.86,32.86 C10.1

### Text on the board
tNames: 1 | TX | ICSP | VIN | RX | GND | RST | GND | RST | SCL | SDA | 5V | GND | 5V | D2 | A7 | D3 | TX | RX | PWR | DL | A6 | D4 | RST | A5 | D5 | A4 | D6 | A3 | D7 | A2 | D8 | A1 | D9 | A0 | D10 | REF | D11 | D12 | 3V3 | D13
bNames: Seeeduino Nano v1.0